# Altium schematic sheet CW342_FPGA_DECOUP.SchDoc: <Enter Sheet Title>
size Letter; Organization: NewAE Technology Inc.; Address1: 1083 Queen St., Suite 196; Address2: Halifax; Address3: NS; Address4: Canada B3H 0B2; SheetNumber: 9; SheetTotal: 9; SheetApproved: NO
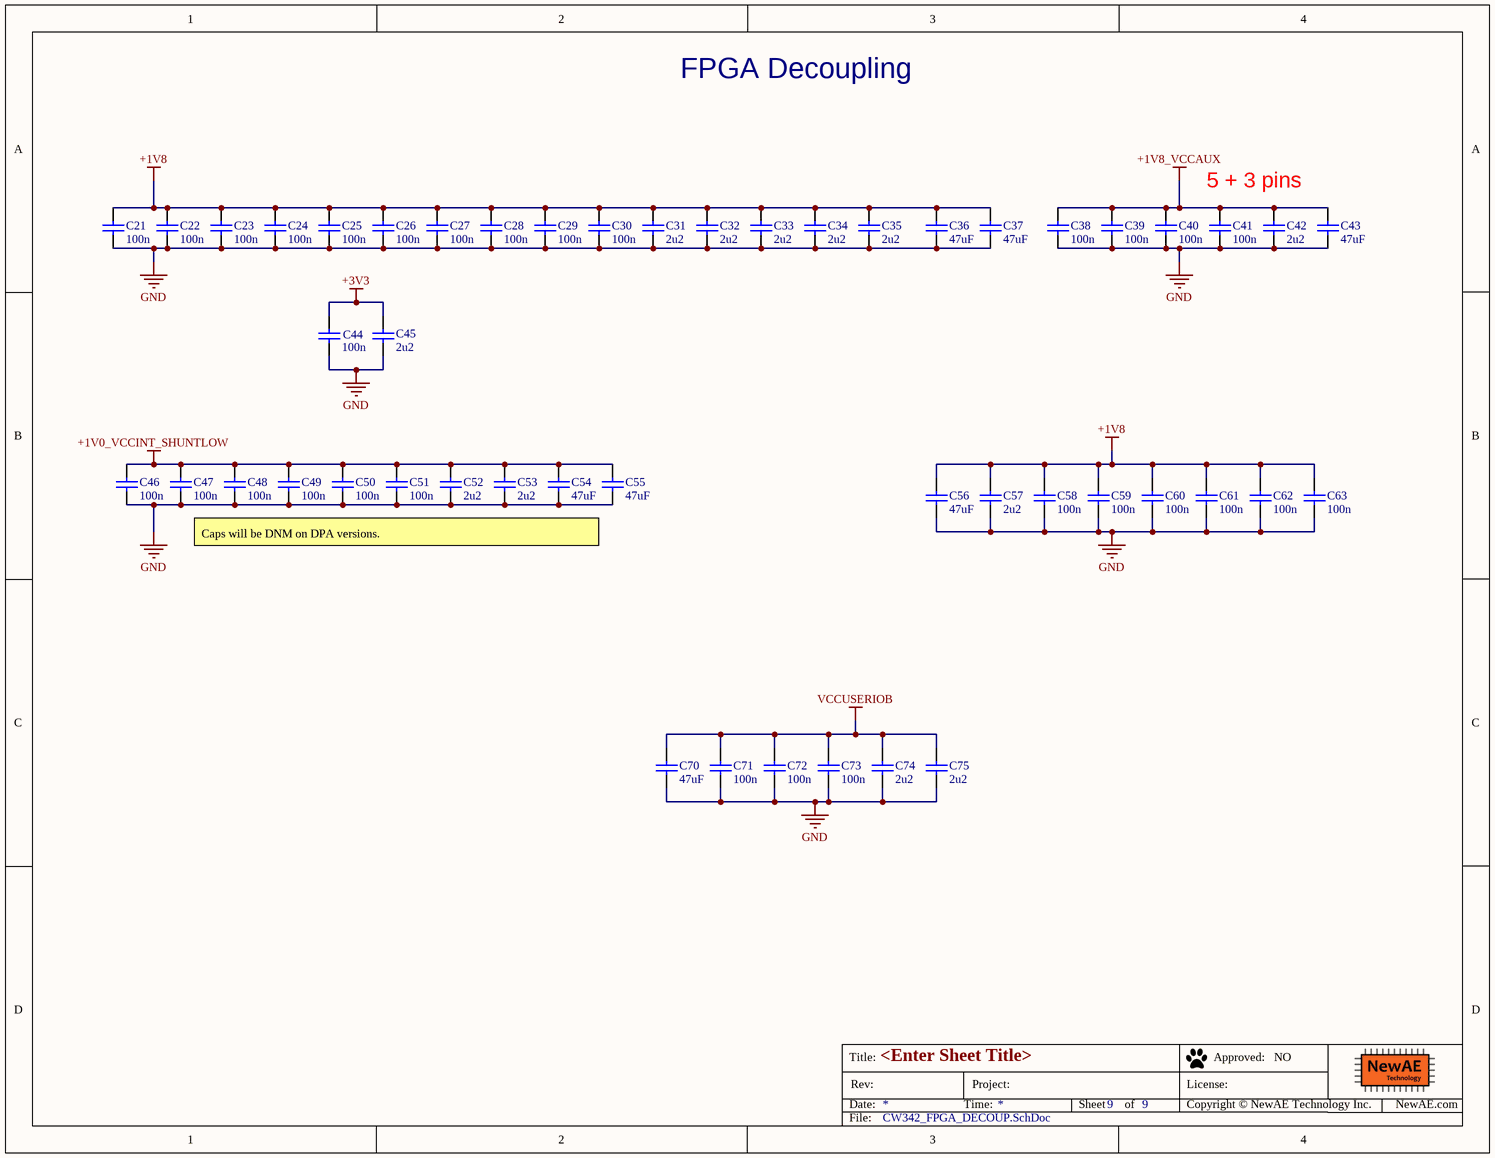
[diagram p0: CW342_FPGA_DECOUP.SchDoc]

## Parts
C21  100n  [CAPC0402_M]
C22  100n  [CAPC0402_M]
C23  100n  [CAPC0402_M]
C24  100n  [CAPC0402_M]
C25  100n  [CAPC0402_M]
C26  100n  [CAPC0402_M]
C27  100n  [CAPC0402_M]
C28  100n  [CAPC0402_M]
C29  100n  [CAPC0402_M]
C30  100n  [CAPC0402_M]
C31  2u2  [CAPC0603_M]
C32  2u2  [CAPC0603_M]
C33  2u2  [CAPC0603_M]
C34  2u2  [CAPC0603_M]
C35  2u2  [CAPC0603_M]
C36  47uF  [CAPC3225X20N]
C37  47uF  [CAPC3225X20N]
C38  100n  [CAPC0402_M]
C39  100n  [CAPC0402_M]
C40  100n  [CAPC0402_M]
C41  100n  [CAPC0402_M]
C42  2u2  [CAPC0603_M]
C43  47uF  [CAPC3225X20N]
C44  100n  [CAPC0402_M]
C45  2u2  [CAPC0603_M]
C46  100n  [CAPC0402_M]
C47  100n  [CAPC0402_M]
C48  100n  [CAPC0402_M]
C49  100n  [CAPC0402_M]
C50  100n  [CAPC0402_M]
C51  100n  [CAPC0402_M]
C52  2u2  [CAPC0603_M]
C53  2u2  [CAPC0603_M]
C54  47uF  [CAPC3225X20N]
C55  47uF  [CAPC3225X20N]
C56  47uF  [CAPC3225X20N]
C57  2u2  [CAPC0603_M]
C58  100n  [CAPC0402_M]
C59  100n  [CAPC0402_M]
C60  100n  [CAPC0402_M]
C61  100n  [CAPC0402_M]
C62  100n  [CAPC0402_M]
C63  100n  [CAPC0402_M]
C70  47uF  [CAPC3225X20N]
C71  100n  [CAPC0402_M]
C72  100n  [CAPC0402_M]
C73  100n  [CAPC0402_M]
C74  2u2  [CAPC0603_M]
C75  2u2  [CAPC0603_M]

## Nets
+1V0_VCCINT_SHUNTLOW: C46.1 C47.1 C48.1 C49.1 C50.1 C51.1 C52.1 C53.1 C54.1 C55.1
+1V8: C21.1 C22.1 C23.1 C24.1 C25.1 C26.1 C27.1 C28.1 C29.1 C30.1 C31.1 C32.1 C33.1 C34.1 C35.1 C36.1 C37.1 C56.1 C57.1 C58.1 C59.1 C60.1 C61.1 C62.1 C63.1
+1V8_VCCAUX: C38.1 C39.1 C40.1 C41.1 C42.1 C43.1
+3V3: C44.1 C45.1
GND: C21.2 C22.2 C23.2 C24.2 C25.2 C26.2 C27.2 C28.2 C29.2 C30.2 C31.2 C32.2 C33.2 C34.2 C35.2 C36.2 C37.2 C38.2 C39.2 C40.2 C41.2 C42.2 C43.2 C44.2 C45.2 C46.2 C47.2 C48.2 C49.2 C50.2 C51.2 C52.2 C53.2 C54.2 C55.2 C56.2 C57.2 C58.2 C59.2 C60.2 C61.2 C62.2 C63.2 C70.2 C71.2 C72.2 C73.2 C74.2 C75.2
VCCUSERIOB: C70.1 C71.1 C72.1 C73.1 C74.1 C75.1

## Notes on the sheet
- FPGA Decoupling
- 5 + 3 pins
- Caps will be DNM on DPA versions.
- Title:
- Date:
- Rev:
- Time:
- Project:
- Sheet
- of
- License:
- Copyright © NewAE Technology Inc.
- Approved:
- NewAE.com
- File:

## Library data of the parts
C21-C30 C38-C41 C44 C46-C51 C58-C63 C71-C73 = CCHIP-100n-0402: 100n, 0402; Manufacture Part Number 1: CGA2B3X7R1V104K050BB; Component Group: Capacitor; Case-EIA: 0402; Part Number: CCHIP-100n-0402; Footprint: 0402; Pin Count: 2; Value: 100n; Mounting Technology: SMT; Component Kind: Standard; Component Type: Standard; Supplier 1: Digi-Key; Supplier Part Number 1: 445-6901-1-ND
C31-C35 C42 C45 C52 C53 C57 C74 C75 = CCHIP-2u2-0603: 2u2, 0603; Manufacture 1: Samsung; Manufacture Part Number 1: CL10B225KP8NNNC; Component Group: Capacitor; Case-EIA: 0603; Case-Metric: 1608; Rated Voltage: 10VDC; Part Number: CCHIP-2u2-0603; Footprint: 0603; Pin Count: 2; Supplier 1: Digi-Key; Supplier Part Number 1: 1276-1134-1-ND; Value: 2u2; Mounting Technology: SMT; Component Kind: Standard; Component Type: Standard
C36 C37 C43 C54-C56 C70 = CCHIP-47u-1210: 47u, 10V, 1210, Ceramic; Manufacture 1: TDK Corporation; Manufacture Part Number 1: C3225X5R1A476M250AC; Component Group: Capacitor; Case-EIA: 1210; Case-Metric: 3225; Rated Voltage: 10VDC; Tolerance: 20%; Part Number: CCHIP-47u-1210; Footprint: 1210; Pin Count: 2; Supplier 1: Digi-Key; Supplier Part Number 1: 445-6711-1-ND; Value: 47uF; Mounting Technology: SMT; Temperature Range: -55C to 85C; Component Kind: Standard; Component Type: Standard